# EAGLE schematic HOTAS_THUMB_v5.brd (EAGLE 9.7.0)
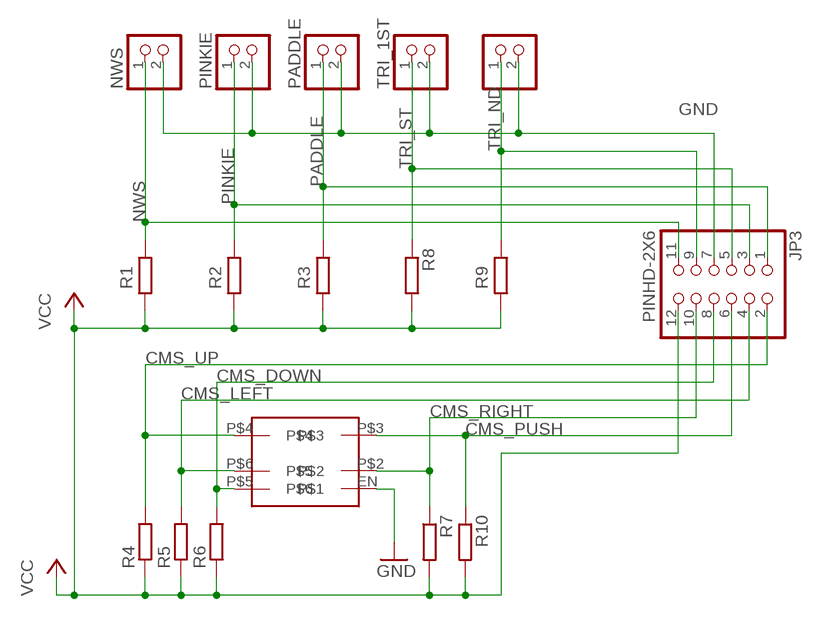
[diagram p0: schematic, sheet 1]

## Parts
JP3  PINHD-2X6  [2X06]
NWS  PINHD-1X2  [1X02]
PADDLE  PINHD-1X2  [1X02]
PINKIE  PINHD-1X2  [1X02]
R1  R_CHIP-1206(3216-METRIC)  [RESC3216X70]
R2  R_CHIP-1206(3216-METRIC)  [RESC3216X70]
R3  R_CHIP-1206(3216-METRIC)  [RESC3216X70]
R4  R_CHIP-1206(3216-METRIC)  [RESC3216X70]
R5  R_CHIP-1206(3216-METRIC)  [RESC3216X70]
R6  R_CHIP-1206(3216-METRIC)  [RESC3216X70]
R7  R_CHIP-1206(3216-METRIC)  [RESC3216X70]
R8  R_CHIP-1206(3216-METRIC)  [RESC3216X70]
R9  R_CHIP-1206(3216-METRIC)  [RESC3216X70]
R10  R_CHIP-1206(3216-METRIC)  [RESC3216X70]
TRI_1ST  PINHD-1X2  [1X02]
TRI_ND  PINHD-1X2  [1X02]
U$1  FIVEWAYHATSSMD  [FIVEWAYHATSSMD]

## Nets
CMS_DOWN: JP3.8 R6.2 U$1.P$5
CMS_LEFT: JP3.4 R5.2 U$1.P$6
CMS_PUSH: JP3.6 R10.1 U$1.P$3
CMS_RIGHT: JP3.10 R7.1 U$1.P$2
CMS_UP: JP3.2 R4.2 U$1.P$4
GND: JP3.7 NWS.2 PADDLE.2 PINKIE.2 TRI_1ST.2 TRI_ND.2 U$1.EN
NWS: JP3.11 NWS.1 R1.1
PADDLE: JP3.1 PADDLE.1 R3.1
PINKIE: JP3.3 PINKIE.1 R2.1
TRI_ND: JP3.9 R9.1 TRI_ND.1
TRI_ST: JP3.5 R8.1 TRI_1ST.1
VCC: JP3.12 R1.2 R2.2 R3.2 R4.1 R5.1 R6.1 R7.2 R8.2 R9.2 R10.2

## Library data of the parts
JP3 = Connector:PINHD-2X6: PIN HEADER; CATEGORY: Headers; DESCRIPTION: Header, Straight, 2x6 Position; MANUFACTURER: Generic; MPN: Generic; OPERATING_TEMPERATURE: Generic; PART_STATUS: Active; PITCH: 0.100" (2.54mm); ROHS_COMPLIANCE: Generic; SERIES: Generic; SUB-CATEGORY: Headers, Male Pins; TYPE: Board to Board or Cable, Unshrouded, Through Hole, Straight
NWS PADDLE PINKIE TRI_1ST TRI_ND = MyStuff:PINHD-1X2: PIN HEADER
R1-R10 = Resistor:R: Resistor Fixed - Generic; CATEGORY: Resistor; SUB-CATEGORY: Fixed
U$1 = FiveWaySMD_V6:FIVEWAYHATSSMD